# Altium schematic sheet Indicator_Board.SchDoc
size A
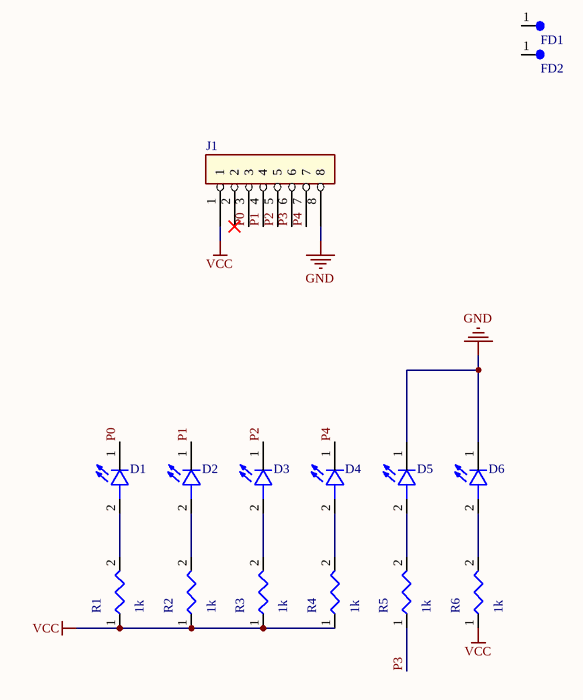
[diagram p0: Indicator_Board.SchDoc]

## Parts
D1  APA3010QBC/G-GX  [LED_APA3010QBC/G-GX]  (value not drawn)
D2  APA3010QBC/G-GX  [LED_APA3010QBC/G-GX]  (value not drawn)
D3  APA3010QBC/G-GX  [LED_APA3010QBC/G-GX]  (value not drawn)
D4  APA3010QBC/G-GX  [LED_APA3010QBC/G-GX]  (value not drawn)
D5  APA3010QBC/G-GX  [LED_APA3010QBC/G-GX]  (value not drawn)
D6  APA3010QBC/G-GX  [LED_APA3010QBC/G-GX]  (value not drawn)
FD1  Fiducial  [FD]  (value not drawn)
FD2  Fiducial  [FD]  (value not drawn)
J1  HEADER 8x1  [CONN_8x1]  (value not drawn)
R1  1k  [1206-R]
R2  1k  [1206-R]
R3  1k  [1206-R]
R4  1k  [1206-R]
R5  1k  [1206-R]
R6  1k  [1206-R]

## Nets
GND: D5.1(C) D6.1(C) J1.8
VCC: J1.1 R1.1 R2.1 R3.1 R4.1 R6.1
P0: D1.1(C) J1.3
P1: D2.1(C) J1.4
P2: D3.1(C) J1.5
P3: J1.6 R5.1
P4: D4.1(C) J1.7
NetD1_2: D1.2(A) R1.2
NetD2_2: D2.2(A) R2.2
NetD3_2: D3.2(A) R3.2
NetD4_2: D4.2(A) R4.2
NetD5_2: D5.2(A) R5.2
NetD6_2: D6.2(A) R6.2

Not connected (* = marked no-connect by the designer): FD1 1; FD2 1; J1 2*

## Library data of the parts
D1-D6 = APA3010QBC/G-GX: Surface Mount LED; Size : 3.0X1.0mm ; Color: Blue; Lens: Water Clear; Package: None; Price: None; Value: *; MP: APA3010QBC/G-GX; Availability: Unavailable
J1 = HEADER 8x1: System: Connector; Syatem: connector
R1-R6 = Res